# Altium project 编码器板.PrjPcb
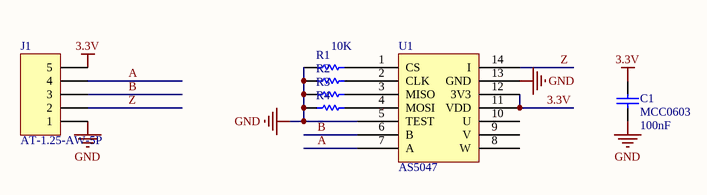
[diagram p0: JHZ-E01S-HW-Sensor-X2-S0.1-磁编码器AS5047-20160919.SchDoc]
3 sheets, 17 parts. Net scope: global (net labels, ports and power ports of the same name join across sheets).
Board files: JHZ-E01S-HW-Sensor-X2-S0.1-磁编码器AS5047-20160919.PcbDoc, JHZ-E01S-HW-Sensor-X3-S0.1-光编码avago-20160919.PcbDoc, JHZ-E01S-HW-Sensor-X1-S0.1-磁编码器AS5600-20160919.PcbDoc
Sheets:
  JHZ-E01S-HW-Sensor-X2-S0.1-磁编码器AS5047-20160919.SchDoc
  JHZ-E01S-HW-Sensor-X3-S0.1-光编码avago-20160919.SchDoc
  JHZ-E01S-HW-Sensor-X1-S0.1-磁编码器AS5600-20160919.SchDoc

## Sheet JHZ-E01S-HW-Sensor-X2-S0.1-磁编码器AS5047-20160919.SchDoc
size A4

### Parts
(Parts that share a designator on the sheet are numbered #1, #2 ... from top to bottom, then left to right.)
C1#1  MCC0603  value 100nF  [C0603_M1608]
J1#1  AT-1.25-AW-5P  [AT-1.25-AW-5P]
R1#1  value 10K  [R0603_M1608]  (hidden comment: R0603_M1608)
R2#1  R0603_M1608  [R0603_M1608]  (value not drawn)
R3#1  R0603_M1608  [R0603_M1608]  (value not drawn)
R4  R0603_M1608  [R0603_M1608]  (value not drawn)
U1#1  AS5047  [TSSOP14_065P]

### Nets
3.3V: C1#1.1 J1#1.5 U1#1.11(VDD) U1#1.12(3V3)
GND: C1#1.2 J1#1.1 R1#1.1 R2#1.1 R3#1.1 R4.1 U1#1.5(TEST) U1#1.13(GND)
A: J1#1.4 U1#1.7(A)
B: J1#1.3 U1#1.6(B)
Z: J1#1.2 U1#1.14(I)
NetR1#1_2: R1#1.2 U1#1.1(CS)
NetR2#1_2: R2#1.2 U1#1.2(CLK)
NetR3#1_2: R3#1.2 U1#1.3(MISO)
NetR4_2: R4.2 U1#1.4(MOSI)

Not connected (* = marked no-connect by the designer): U1#1 8(W) 9(V) 10(U)

### Library data of the parts
C1#1 = MCC0603: Multilayer Ceramic Capacitor 0603
J1#1 = 1.25T-1-A-5P: Header, 1.25mm,5-Pin; Value: AT-1.25-AW-5P
R1#1 = R0603_M1608: Resistor
R2#1 R3#1 R4 = R0603_M1608: Resistor; Value: 10K

## Sheet JHZ-E01S-HW-Sensor-X3-S0.1-光编码avago-20160919.SchDoc
size A4
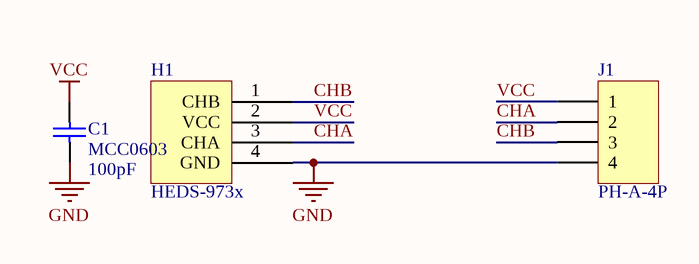
[diagram p1: JHZ-E01S-HW-Sensor-X3-S0.1-光编码avago-20160919.SchDoc]

### Parts
(Parts that share a designator on the sheet are numbered #1, #2 ... from top to bottom, then left to right.)
C1#2  MCC0603  value 100pF  [C0603_M1608]
H1  HEDS-973x  [HEDS-973x]
J1#2  PH-A-4P  [PH-A-4P]

### Nets
GND: C1#2.2 H1.4(GND) J1#2.4
VCC: C1#2.1 H1.2(VCC) J1#2.1
CHA: H1.3(CHA) J1#2.2
CHB: H1.1(CHB) J1#2.3

### Library data of the parts
C1#2 = MCC0603: Multilayer Ceramic Capacitor 0603
J1#2 = PH-A-4P: Header, 2.0mm,4-Pin; Value: PH-A-4P

## Sheet JHZ-E01S-HW-Sensor-X1-S0.1-磁编码器AS5600-20160919.SchDoc
size A4
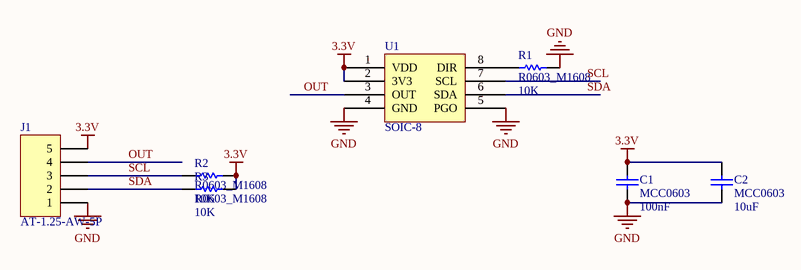
[diagram p2: JHZ-E01S-HW-Sensor-X1-S0.1-磁编码器AS5600-20160919.SchDoc]

### Parts
(Parts that share a designator on the sheet are numbered #1, #2 ... from top to bottom, then left to right.)
C1#3  MCC0603  value 100nF  [C0603_M1608]
C2  MCC0603  value 10uF  [C0603_M1608]
J1#3  AT-1.25-AW-5P  [AT-1.25-AW-5P]
R1#2  R0603_M1608  value 10K  [R0603_M1608]
R2#2  R0603_M1608  value 10K  [R0603_M1608]
R3#2  R0603_M1608  value 10K  [R0603_M1608]
U1#2  SOIC-8  [SOIC-8]

### Nets
3.3V: C1#3.1 C2.1 J1#3.5 R2#2.1 R3#2.1 U1#2.1(VDD) U1#2.2(3V3)
GND: C1#3.2 C2.2 J1#3.1 R1#2.2 U1#2.4(GND) U1#2.5(PGO)
OUT: J1#3.4 U1#2.3(OUT)
SCL: J1#3.3 R2#2.2 U1#2.7(SCL)
SDA: J1#3.2 R3#2.2 U1#2.6(SDA)
NetR1#2_1: R1#2.1 U1#2.8(DIR)

### Library data of the parts
C1#3 C2 = MCC0603: Multilayer Ceramic Capacitor 0603
J1#3 = 1.25T-1-A-5P: Header, 1.25mm,5-Pin; Value: AT-1.25-AW-5P
R1#2 R2#2 R3#2 = R0603_M1608: Resistor
U1#2 = AS5600

## Nets that join several sheets
3.3V: JHZ-E01S-HW-Sensor-X2-S0.1-磁编码器AS5047-20160919 (C1#1.1 J1#1.5 U1#1.11 U1#1.12), JHZ-E01S-HW-Sensor-X1-S0.1-磁编码器AS5600-20160919 (7 pins)
GND: JHZ-E01S-HW-Sensor-X2-S0.1-磁编码器AS5047-20160919 (8 pins), JHZ-E01S-HW-Sensor-X3-S0.1-光编码avago-20160919 (C1#2.2 H1.4 J1#2.4), JHZ-E01S-HW-Sensor-X1-S0.1-磁编码器AS5600-20160919 (6 pins)